# Altium schematic sheet Indicator Display.SchDoc
size A
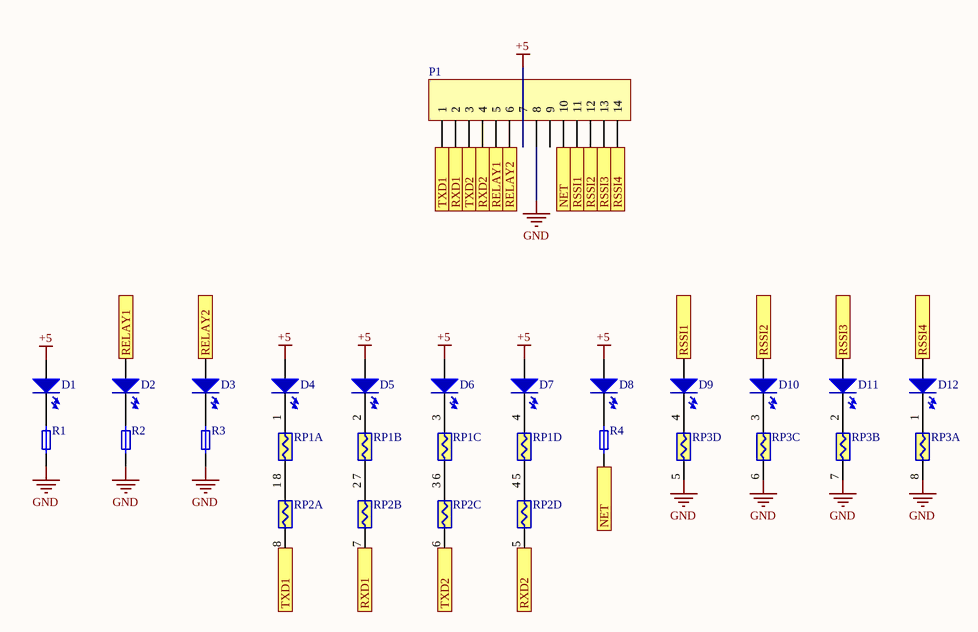
[diagram p0: Indicator Display.SchDoc]

## Parts
D1  SMD LED  [LED RED 3MM S]  (value not drawn)
D2  SMD LED  [LED RED 3MM S]  (value not drawn)
D3  SMD LED  [LED RED 3MM S]  (value not drawn)
D4  SMD LED  [LED RED 3MM S]  (value not drawn)
D5  SMD LED  [LED RED 3MM S]  (value not drawn)
D6  SMD LED  [LED RED 3MM S]  (value not drawn)
D7  SMD LED  [LED RED 3MM S]  (value not drawn)
D8  SMD LED  [LED RED 3MM S]  (value not drawn)
D9  SMD LED  [LED RED 3MM S]  (value not drawn)
D10  SMD LED  [LED RED 3MM S]  (value not drawn)
D11  SMD LED  [LED RED 3MM S]  (value not drawn)
D12  SMD LED  [LED RED 3MM S]  (value not drawn)
P1  Header 14  [HDR1X14]  (value not drawn)
R1  PTS120630V012  [1206 Resistor]  (value not drawn)
R2  PTS120630V012  [1206 Resistor]  (value not drawn)
R3  PTS120630V012  [1206 Resistor]  (value not drawn)
R4  PTS120630V012  [1206 Resistor]  (value not drawn)
RP1  Resistor Pack 4x1  [RP4x0603]  (value not drawn)  (parts A,B,C,D of 4)
RP2  Resistor Pack 4x1  [RP4x0603]  (value not drawn)  (parts A,B,C,D of 4)
RP3  Resistor Pack 4x1  [RP4x0603]  (value not drawn)  (parts A,B,C,D of 4)

## Ports
NET, RELAY1, RELAY2, RSSI1, RSSI2, RSSI3, RSSI4, RXD1, RXD2, TXD1, TXD2

## Nets
+5: D4.1(A) D5.1(A) D6.1(A) D7.1(A) D8.1(A) P1.7
GND: P1.8 R1.1 R2.1 R3.1 RP3.5 RP3.6 RP3.7 RP3.8
NET: P1.10 R4.1 ; port NET
RELAY1: D2.1(A) P1.5 ; port RELAY1
RELAY2: D3.1(A) P1.6 ; port RELAY2
RSSI1: D9.1(A) P1.11 ; port RSSI1
RSSI2: D10.1(A) P1.12 ; port RSSI2
RSSI3: D11.1(A) P1.13 ; port RSSI3
RSSI4: D12.1(A) P1.14 ; port RSSI4
RXD1: P1.2 RP2.7 ; port RXD1
RXD2: P1.4 RP2.5 ; port RXD2
TXD1: P1.1 RP2.8 ; port TXD1
TXD2: P1.3 RP2.6 ; port TXD2
NetD1_2: D1.2(K) R1.2
NetD2_2: D2.2(K) R2.2
NetD3_2: D3.2(K) R3.2
NetD4_2: D4.2(K) RP1.1
NetD5_2: D5.2(K) RP1.2
NetD6_2: D6.2(K) RP1.3
NetD7_2: D7.2(K) RP1.4
NetD8_2: D8.2(K) R4.2
NetD9_2: D9.2(K) RP3.4
NetD10_2: D10.2(K) RP3.3
NetD11_2: D11.2(K) RP3.2
NetD12_2: D12.2(K) RP3.1
NetRP1_5: RP1.5 RP2.4
NetRP1_6: RP1.6 RP2.3
NetRP1_7: RP1.7 RP2.2
NetRP1_8: RP1.8 RP2.1

Not connected (* = marked no-connect by the designer): D1 1(A); P1 9

## Notes on the sheet
- Labels drawn without touching a wire or pin: +5

## Library data of the parts
D1-D12 = LED SMD
P1 = Header 14: Header, 14-Pin; LatestRevisionDate: 17-Jul-2002; LatestRevisionNote: Re-released for DXP Platform.; Publisher: Altium Limited
RP1-RP3 = Resistor Pack 4*1